# EAGLE design SoilSensor (EAGLE 7.7.0)
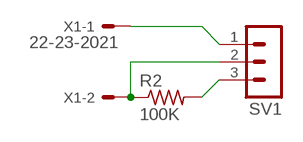
[diagram p0: schematic, sheet 1]

## Parts
R2  100K  R-US_0411/15  [0411/15]
SV1  MA03-1  [MA03-1]
X1  22-23-2021  [22-23-2021]

## Nets
N$1: SV1.1 X1.1
N$2: R2.1 SV1.2 X1.2
N$3: R2.2 SV1.3

## Library data of the parts
R2 = rcl:R-US_: RESISTOR, American symbol
SV1 = con-lstb:MA03-1: PIN HEADER; OC_FARNELL: unknown; OC_NEWARK: unknown
X1 = con-molex:22-23-2021: .100" (2.54mm) Center Header - 2 Pin; MF: MOLEX; MPN: 22-23-2021; OC_FARNELL: 1462926; OC_NEWARK: 25C3832

## Board
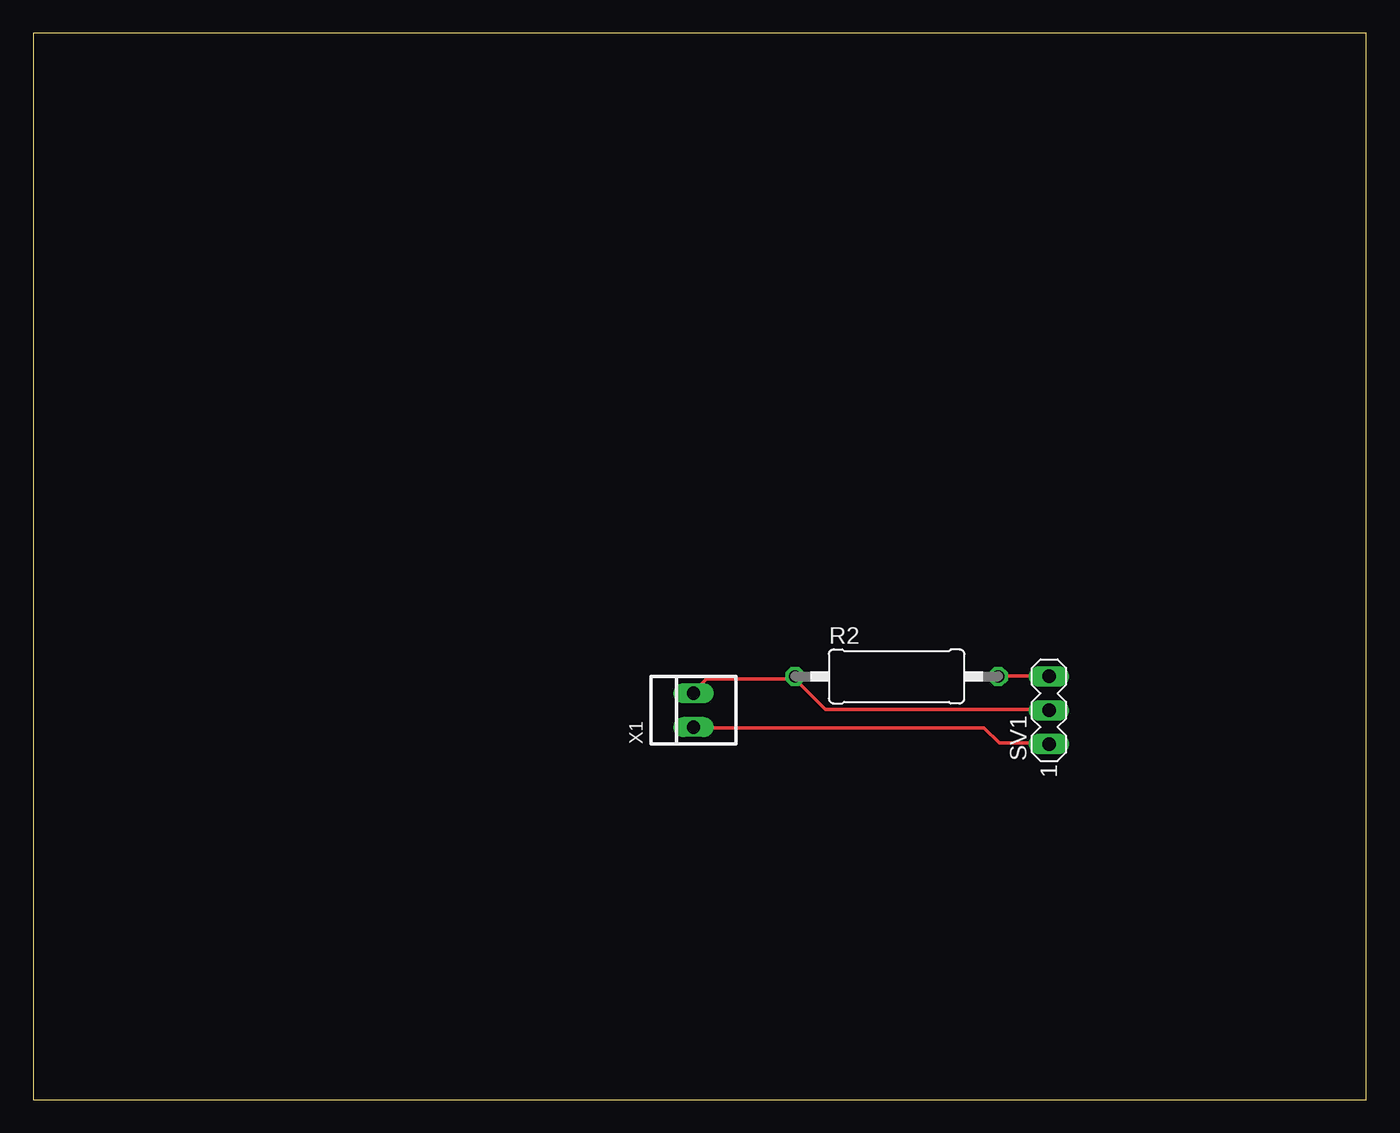
[diagram p1: board, top side]

Size 100 x 80 mm. Coordinates in mm from the lower left corner, seen from the top.
Outline: 0,0 100,0 100,80 0,80 0,0
Copper layers (1*16): Top 0.035mm / dielectric 1.5mm / Bottom 0.035mm
Design rules "default": minimum track width 10mil, minimum drill 24mil, track to track 8mil, track to pad 8mil, pad to pad 8mil, via to via 8mil, smd to smd 8mil, copper to edge 40mil, drill to drill 8mil, minimum pad ring 10mil, minimum via ring 8mil, stop-mask expansion 4mil, vias tented up to drill 0mil, thermal gap 10mil

### Footprints (pad centres in the part's own frame; a part is rotated, then mirrored left to right if it is on the bottom)
0411/15 = drill 0.914 octagon: 1 -7.62,0; 2 7.62,0
MA03-1 = drill 1.016 long: 1 -2.54,0; 2 0,0; 3 2.54,0
22-23-2021 = drill 1 long: 1 -1.27,0; 2 1.27,0

### Placement (x,y rotation side)
R2  64.77,31.75 0 top
SV1  76.2,29.21 90 top
X1  49.53,29.21 90 top

### Tracks (layer width: path | path; a pad name or v marks a point on that pad's centre or on a via)
N$1
  Top 0.254: SV1.1 76.12,26.75 72.47,26.75 71.32,27.89 49.61,27.89 X1.1
N$2
  Top 0.254: 57.15,31.55 50.52,31.55 49.61,30.63 X1.2 | 57.15,31.55 59.44,29.26 76.12,29.26 SV1.2 | 57.15,31.55 R2.1
N$3
  Top 0.254: R2.2 72.47,31.77 76.12,31.77 SV1.3